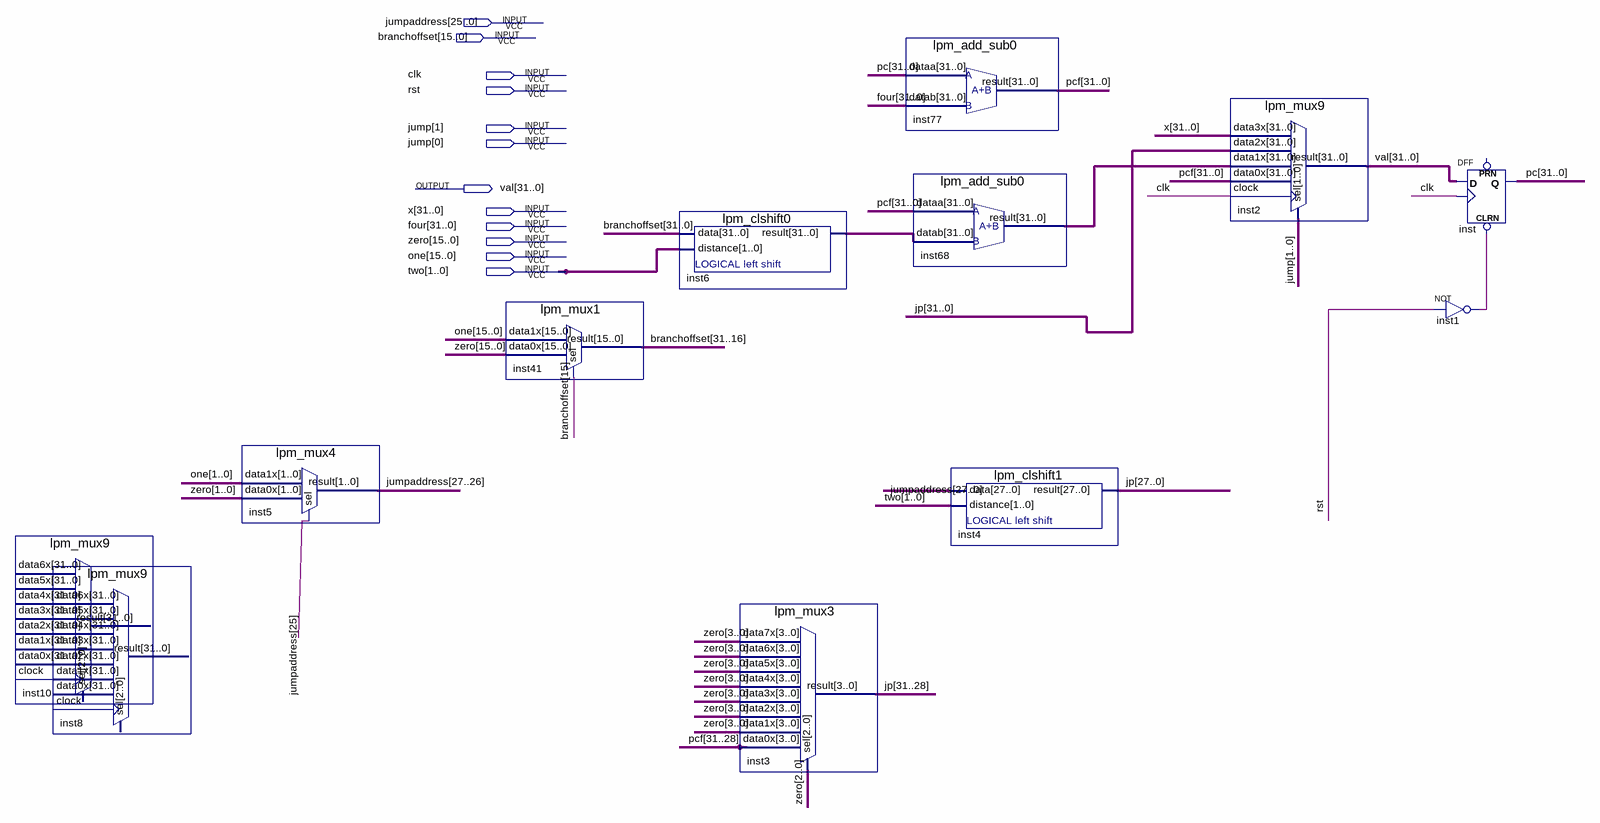
[diagram p0: schematic sheet]
// Quartus schematic CA6.bdf as structural Verilog: 12 symbols, 12 pins
module CA6 (
  input  [27:0] jumpaddress,
  input  [31:0] branchoffset,
  input  clk,
  input  rst,
  input  [1:0] jump,
  input  [31:0] x,
  input  [31:0] four,
  input  [15:0] zero,
  input  [15:0] one,
  input  [1:0] two,
  output [31:0] val
);

  wire inst1_out;
  wire [31:0] inst6_result, inst68_result, jp, pc, pcf;

  lpm_mux9 inst10 ();  // open: data6x, data5x, data4x, data3x, data2x, data1x, data0x, clock, sel, result
  lpm_mux9 inst8 ();  // open: data6x, data5x, data4x, data3x, data2x, data1x, data0x, clock, sel, result
  lpm_mux4 inst5 (.data1x(one[1:0]), .data0x(zero[1:0]), .sel(jumpaddress[25]), .result(jumpaddress[27:26]));
  lpm_mux1 inst41 (.data1x(one), .data0x(zero), .sel(branchoffset[15]), .result(branchoffset[31:16]));
  lpm_clshift0 inst6 (.data(branchoffset), .distance(two), .result(inst6_result));
  lpm_mux3 inst3 (
    .data7x(zero[3:0]), .data6x(zero[3:0]), .data5x(zero[3:0]), .data4x(zero[3:0]), .data3x(zero[3:0]),
    .data2x(zero[3:0]), .data1x(zero[3:0]), .data0x(pcf[31:28]), .sel(zero[2:0]), .result(jp[31:28]));
  lpm_add_sub0 inst77 (.dataa(pc), .datab(four), .result(pcf));
  lpm_add_sub0 inst68 (.dataa(pcf), .datab(inst6_result), .result(inst68_result));
  lpm_clshift1 inst4 (.data(jumpaddress), .distance(two), .result(jp[27:0]));
  lpm_mux9 inst2 (.data3x(x), .data2x(jp), .data1x(inst68_result), .data0x(pcf), .clock(clk), .sel(jump), .result(val));
  DFF inst[31:0] (.CLRN(inst1_out), .CLK(clk), .D(val), .Q(pc));  // open: PRN
  not inst1 (inst1_out, rst);
endmodule
